# Altium project Digital Clock Schematic.PrjPcb
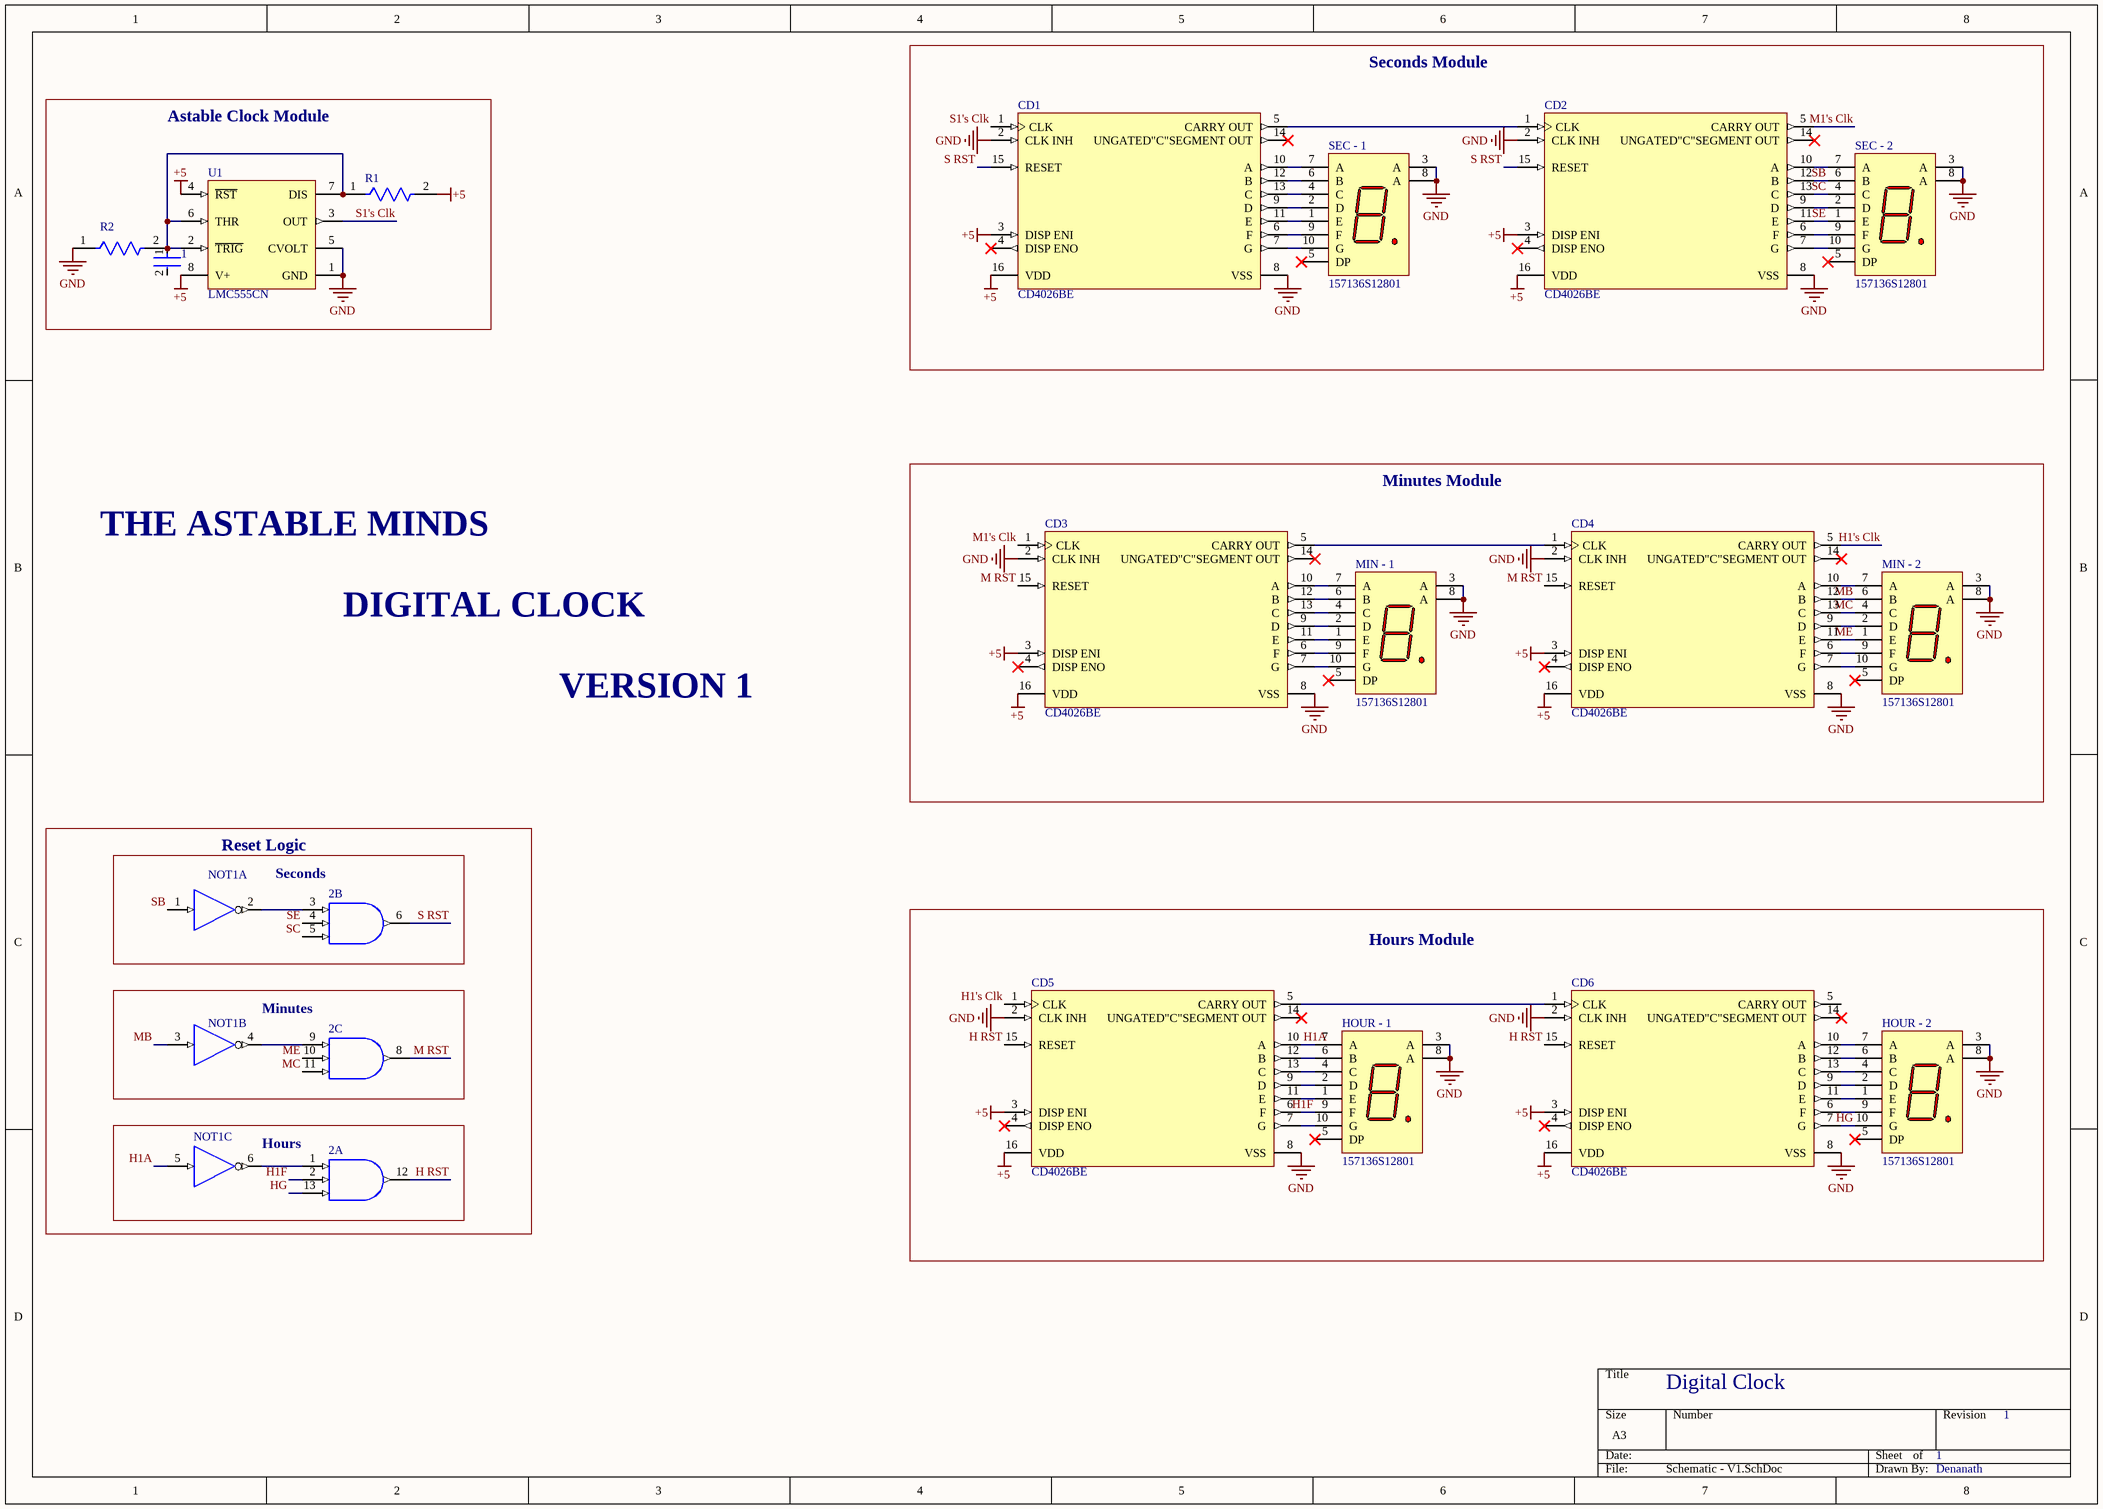
[diagram p0: Schematic - V1.SchDoc]
2 sheets, 43 parts. Net scope: global (net labels, ports and power ports of the same name join across sheets).
Sheets:
  Schematic - V1.SchDoc
  Schematic - V2.SchDoc

## Sheet Schematic - V1.SchDoc
size A3; SheetNumber: 1; SheetTotal: 2

### Parts
(Parts that share a designator on the sheet are numbered #1, #2 ... from top to bottom, then left to right.)
1#1  VY1472M63Y5UQ6TV0  [FP-VY1472M63Y5UQ6TV0-MFG]  (value not drawn)
2  SN74LS11N  [N0014A]  (value not drawn)  (parts A,B,C of 4)
CD1  CD4026BE  [N0016A]
CD2  CD4026BE  [N0016A]
CD3  CD4026BE  [N0016A]
CD4  CD4026BE  [N0016A]
CD5  CD4026BE  [N0016A]
CD6  CD4026BE  [N0016A]
HOUR_-_1  157136S12801  [WL-T7DS_L17.5W12.4H7]
HOUR_-_2  157136S12801  [WL-T7DS_L17.5W12.4H7]
MIN_-_1  157136S12801  [WL-T7DS_L17.5W12.4H7]
MIN_-_2  157136S12801  [WL-T7DS_L17.5W12.4H7]
NOT1  SN74HCU04N  [N0014A]  (value not drawn)  (parts A,B,C of 7)
R1#1  VR37000001204JA100  [FP-VR37-MFG]  (value not drawn)
R2#1  VR37000001204JA100  [FP-VR37-MFG]  (value not drawn)
SEC_-_1  157136S12801  [WL-T7DS_L17.5W12.4H7]
SEC_-_2  157136S12801  [WL-T7DS_L17.5W12.4H7]
U1#1  LMC555CN  [P0008A]

### Blocks framed on the sheet
Seconds Module: CD1 CD2 SEC_-_1 SEC_-_2
Astable Clock Module: 1#1 R1#1 R2#1 U1#1
Minutes Module: CD3 CD4 MIN_-_1 MIN_-_2
Reset Logic: 2 NOT1
Hours Module: CD5 CD6 HOUR_-_1 HOUR_-_2
Minutes: 2 NOT1
Hours: 2 NOT1

### Nets
+5: CD1.3(DISP_ENI) CD1.16(VDD) CD2.3(DISP_ENI) CD2.16(VDD) CD3.3(DISP_ENI) CD3.16(VDD) CD4.3(DISP_ENI) CD4.16(VDD) CD5.3(DISP_ENI) CD5.16(VDD) CD6.3(DISP_ENI) CD6.16(VDD) R1#1.2 U1#1.4(~{RST}) U1#1.8(V+)
GND: CD1.2(CLK_INH) CD1.8(VSS) CD2.2(CLK_INH) CD2.8(VSS) CD3.2(CLK_INH) CD3.8(VSS) CD4.2(CLK_INH) CD4.8(VSS) CD5.2(CLK_INH) CD5.8(VSS) CD6.2(CLK_INH) CD6.8(VSS) HOUR_-_1.3(A) HOUR_-_1.8(A) HOUR_-_2.3(A) HOUR_-_2.8(A) MIN_-_1.3(A) MIN_-_1.8(A) MIN_-_2.3(A) MIN_-_2.8(A) R2#1.1 SEC_-_1.3(A) SEC_-_1.8(A) SEC_-_2.3(A) SEC_-_2.8(A) U1#1.1(GND) U1#1.5(CVOLT)
H1's Clk: CD4.5(CARRY_OUT) CD5.1(CLK)
H1A: NOT1.5(3A)
H1F: 2.2(1B) CD5.6(F) HOUR_-_1.9(F)
H RST: 2.6(2Y) 2.8(3Y) 2.12(1Y) CD1.15(RESET) CD2.15(RESET) CD3.15(RESET) CD4.15(RESET) CD5.15(RESET) CD6.15(RESET)  [also labelled M RST, S RST]
HG: 2.13(1C) CD6.7(G) HOUR_-_2.10(G)
M1's Clk: CD2.5(CARRY_OUT) CD3.1(CLK)
MB: CD4.12(B) MIN_-_2.6(B) NOT1.3(2A)
MC: 2.11(3C) CD4.13(C) MIN_-_2.4(C)
ME: 2.10(3B) CD4.11(E) MIN_-_2.1(E)
S1's Clk: CD1.1(CLK) U1#1.3(OUT)
SB: CD2.12(B) NOT1.1(1A) SEC_-_2.6(B)
SC: 2.5(2C) CD2.13(C) SEC_-_2.4(C)
SE: 2.4(2B) CD2.11(E) SEC_-_2.1(E)
Net1#1_1: 1#1.1 R1#1.1 R2#1.2 U1#1.2(~{TRIG}) U1#1.6(THR) U1#1.7(DIS)
Net2_1: 2.1(1A) NOT1.6(~{3Y})
Net2_3: 2.3(2A) NOT1.2(~{1Y})
Net2_9: 2.9(3A) NOT1.4(~{2Y})
NetCD1_5: CD1.5(CARRY_OUT) CD2.1(CLK)
NetCD1_6: CD1.6(F) SEC_-_1.9(F)
NetCD1_7: CD1.7(G) SEC_-_1.10(G)
NetCD1_9: CD1.9(D) SEC_-_1.2(D)
NetCD1_10: CD1.10(A) SEC_-_1.7(A)
NetCD1_11: CD1.11(E) SEC_-_1.1(E)
NetCD1_12: CD1.12(B) SEC_-_1.6(B)
NetCD1_13: CD1.13(C) SEC_-_1.4(C)
NetCD2_6: CD2.6(F) SEC_-_2.9(F)
NetCD2_7: CD2.7(G) SEC_-_2.10(G)
NetCD2_9: CD2.9(D) SEC_-_2.2(D)
NetCD2_10: CD2.10(A) SEC_-_2.7(A)
NetCD3_5: CD3.5(CARRY_OUT) CD4.1(CLK)
NetCD3_6: CD3.6(F) MIN_-_1.9(F)
NetCD3_7: CD3.7(G) MIN_-_1.10(G)
NetCD3_9: CD3.9(D) MIN_-_1.2(D)
NetCD3_10: CD3.10(A) MIN_-_1.7(A)
NetCD3_11: CD3.11(E) MIN_-_1.1(E)
NetCD3_12: CD3.12(B) MIN_-_1.6(B)
NetCD3_13: CD3.13(C) MIN_-_1.4(C)
NetCD4_6: CD4.6(F) MIN_-_2.9(F)
NetCD4_7: CD4.7(G) MIN_-_2.10(G)
NetCD4_9: CD4.9(D) MIN_-_2.2(D)
NetCD4_10: CD4.10(A) MIN_-_2.7(A)
NetCD5_5: CD5.5(CARRY_OUT) CD6.1(CLK)
NetCD5_7: CD5.7(G) HOUR_-_1.10(G)
NetCD5_9: CD5.9(D) HOUR_-_1.2(D)
NetCD5_10: CD5.10(A) HOUR_-_1.7(A)
NetCD5_11: CD5.11(E) HOUR_-_1.1(E)
NetCD5_12: CD5.12(B) HOUR_-_1.6(B)
NetCD5_13: CD5.13(C) HOUR_-_1.4(C)
NetCD6_6: CD6.6(F) HOUR_-_2.9(F)
NetCD6_9: CD6.9(D) HOUR_-_2.2(D)
NetCD6_10: CD6.10(A) HOUR_-_2.7(A)
NetCD6_11: CD6.11(E) HOUR_-_2.1(E)
NetCD6_12: CD6.12(B) HOUR_-_2.6(B)
NetCD6_13: CD6.13(C) HOUR_-_2.4(C)

Not connected (* = marked no-connect by the designer): 1#1 2; CD1 4(DISP_ENO)* 14(UNGATED"C"SEGMENT_OUT)*; CD2 4(DISP_ENO)* 14(UNGATED"C"SEGMENT_OUT)*; CD3 4(DISP_ENO)* 14(UNGATED"C"SEGMENT_OUT)*; CD4 4(DISP_ENO)* 14(UNGATED"C"SEGMENT_OUT)*; CD5 4(DISP_ENO)* 14(UNGATED"C"SEGMENT_OUT)*; CD6 4(DISP_ENO)* 5(CARRY_OUT) 14(UNGATED"C"SEGMENT_OUT)*; HOUR_-_1 5(DP)*; HOUR_-_2 5(DP)*; MIN_-_1 5(DP)*; MIN_-_2 5(DP)*; SEC_-_1 5(DP)*; SEC_-_2 5(DP)*

### Notes on the sheet
- THE ASTABLE MINDS
- DIGITAL CLOCK
- VERSION 1
- (near 2) Seconds
- Digital Clock
- 1
- Denanath
- Labels drawn without touching a wire or pin: H1A

### Library data of the parts
1#1 = CMP-02417-000050-1: CAP CER 4700PF 760VAC Y5U RADIAL; Voltage Rating (AC): 500V; Lead Diameter: 0.6mm; Capacitance: 4.7nF; Tolerance: 20%; Lead/Base Style: Kinked; Termination: Radial; Resistor Type: Ceramic; Radiation Hardening: No; Diameter: 16mm; Max Operating Temperature: 125°C; Case/Package: Radial; Thickness: 5mm; Lead Pitch: 10mm; Series: VY1; Contact Plating: Tin; Depth: 5mm; RoHS Compliant: Yes; Voltage: 500V; Voltage Rating (DC): 500V; Package Quantity: 500; Construction: RADIAL; Min Operating Temperature: -40°C; Height: 19mm; Height - Seated (Max): 0.787inch; Packaging: Tape and Reel; Dielectric: Y5U; Mount: Through Hole
2 = CMP-0777-00254-3: Triple 3-input positive-AND gates, N0014A, TUBE; Manufacturer: Texas Instruments; Output Type: TTL; VCC(Min)(V): 4.75; Technology Family: LS; Bits(#): 3; Voltage(Nom)(V): 5; ICC @ Nom Voltage(Max)(mA): 0.0036; Rating: Catalog; VCC(Max)(V): 5.25; tpd @ Nom Voltage(Max)(ns): 15; Output Drive (IOL/IOH)(Max)(mA): 0/8; F @ Nom Voltage(Max)(Mhz): 35; Schmitt Trigger: No; Input Type: TTL; DatasheetVersion: SDLS131; PackageReference: N0014A; Operating Temperature Range(C): 0 to 70; Generic Part Number: SN74LS11
CD1-CD6 = CMP-1623-00561-2: CMOS Decade Counter/Divider with Decoded 7-Segment Display Outputs and Display Enable, N0016A, TUBE; Manufacturer: Texas Instruments; ICC @ Nom Voltage(Max)(mA): 0.03; tpd @ Nom Voltage(Max)(ns): 250; F @ Nom Voltage(Max)(Mhz): 8; Bits(#): 7; VCC(Max)(V): 18; VCC(Min)(V): 3; Output Drive (IOL/IOH)(Max)(mA): 1.5/-1.5; Inputs: 1; Rating: Catalog; Technology Family: CD4000; Schmitt Trigger: No; Voltage(Nom)(V): 5,10,15; DatasheetVersion: SCHS031B; Operating Temperature Range(C): -55 to 125; Code_JEDEC: MS-001; Input Type: CMOS; Output Type: CMOS; Type: Decade; Generic Part Number: CD4026B; PackageReference: N0016A; Function: Counter
HOUR_-_1 HOUR_-_2 MIN_-_1 MIN_-_2 SEC_-_1 SEC_-_2 = CMP-03913-119893999-3: 7-Seg Display, Comm Anode, Super Red Rohs Compliant: Yes; Forward Voltage: 2V; Dominant Wavelength: 635nm; Max Reverse Voltage (DC): 5V; Forward Current: 100mA; Luminous Intensity: 20mcd; Width: 12.4mm; Max Operating Temperature: 85°C; Min Operating Temperature: -40°C; Height: 7mm; RoHS: Compliant; Length: 17.5mm
NOT1 = CMP-1615-00910-2: Hex Inverters, N0014A, TUBE; Manufacturer: Texas Instruments; Technology Family: HC; Bits(#): 6; Schmitt Trigger: No; Output Drive (IOL/IOH)(Max)(mA): -4/4; Input Type: CMOS; F @ Nom Voltage(Max)(Mhz): 20; VCC(Min)(V): 2; Voltage(Nom)(V): 5; ICC @ Nom Voltage(Max)(mA): 0.02; Rating: Catalog; Operating Temperature Range(C): -40 to 85; Generic Part Number: SN74HCU04; VCC(Max)(V): 6; PackageReference: N0014A; tpd @ Nom Voltage(Max)(ns): 20; Output Type: CMOS; Code_JEDEC: MS-001; DatasheetVersion: SCLS079E
R1#1 R2#1 = CMP-02408-000054-1: RES 1.2M OHM 5% 1/2W AXIAL; Voltage Rating: 3.5kV; Power Rating: 500mW; Temperature Coefficient: 200ppm/°C; Resistance: 1.2MR; Diameter: 4mm; Max Operating Temperature: 155°C; Military Standard: Not; Reach SVHC Compliant: Yes; Min Operating Temperature: -55°C; Resistance Tolerance: 5%; Resistor Type: Metal Film; Tolerance: 5%; Mount: Through Hole; Construction: Cylindrical; Contact Plating: Tin; Length: 10mm; Termination: Axial; Voltage Rating (DC): 3.5kV; Packaging: Ammo Pack; Radiation Hardening: No; Case/Package: Conformal
U1#1 = CMP-0056-00035-3: CMOS Timer, 8-pin MDIP; Manufacturer: Texas Instruments; PowerWise: N; CompType: Analog IC; PackageTopMarking: NSUZXYTTE#*LMC*555CN; PackageReference: P0008A; ComponentLink1Description: Datasheet URL; PinCount: 8; ComponentLink1URL: http://www.ti.com/general/docs/lit/getliterature.tsp?genericPartNumber=LMC555&fileType=pdf; PackageDescription: MDIP, .365 x .250 x .130in, 8 Lead, .100in Pitch; RoHS: N; Code_JEDEC: MS-001-BA

## Sheet Schematic - V2.SchDoc
size A3; SheetNumber: 2; SheetTotal: 2
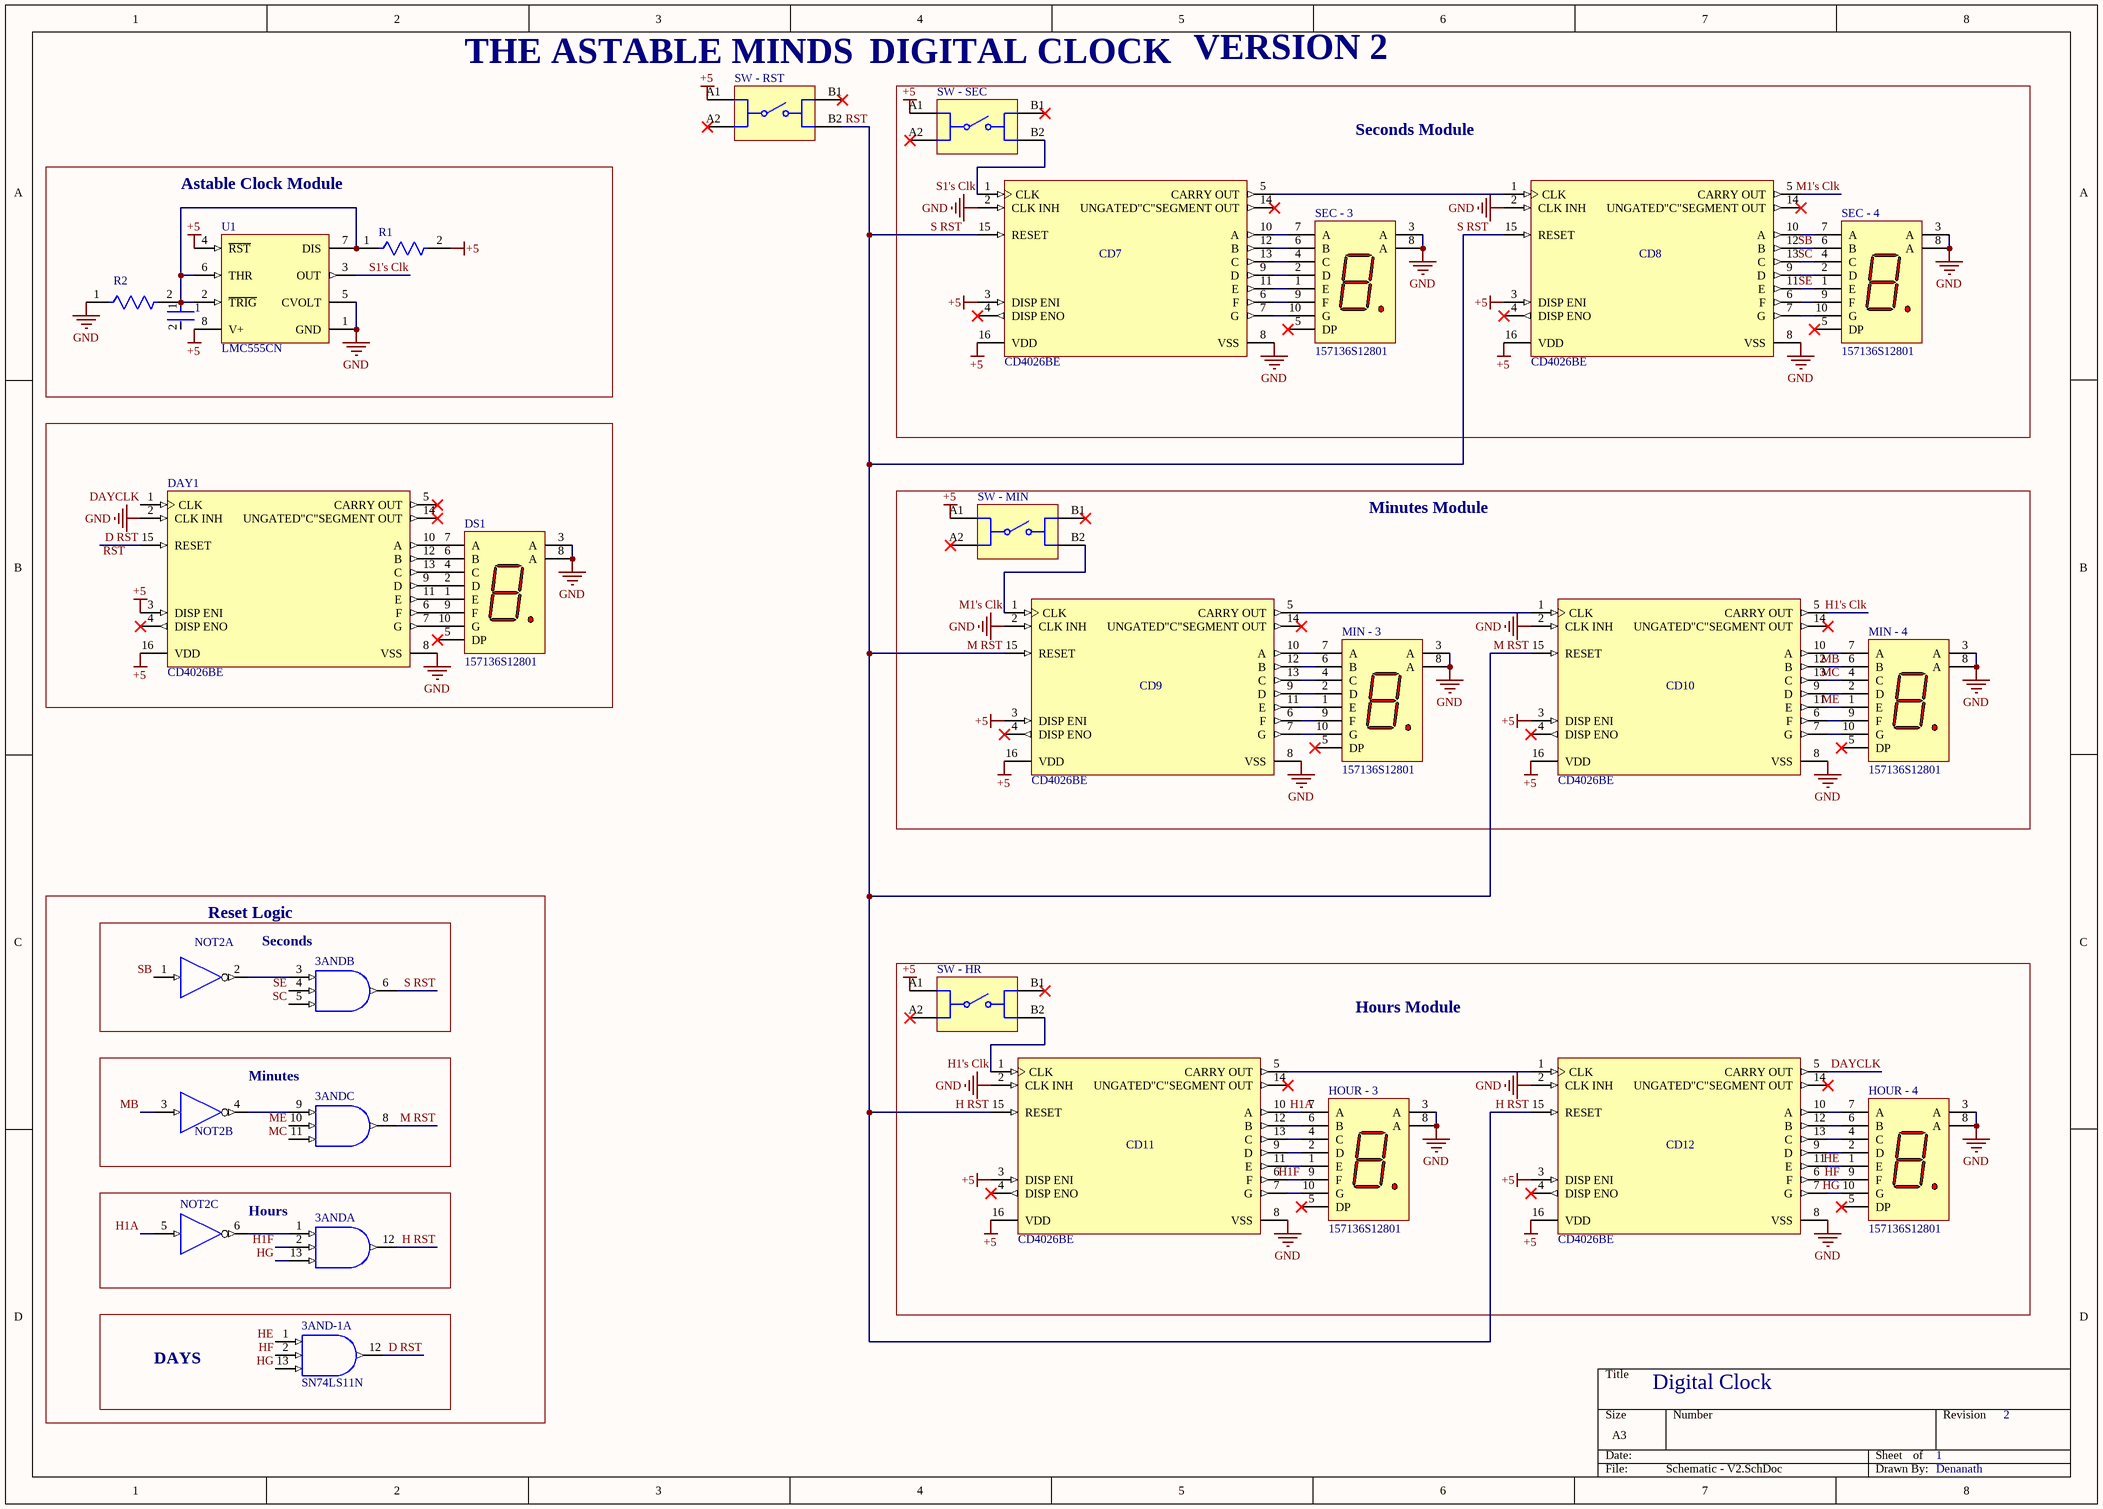
[diagram p1: Schematic - V2.SchDoc]

### Parts
(Parts that share a designator on the sheet are numbered #1, #2 ... from top to bottom, then left to right.)
1#2  VY1472M63Y5UQ6TV0  [FP-VY1472M63Y5UQ6TV0-MFG]  (value not drawn)
3AND  SN74LS11N  [N0014A]  (value not drawn)  (parts A,B,C of 4)
3AND-1  SN74LS11N  [N0014A]  (part A of 4)
CD7  CD4026BE  [N0016A]
CD8  CD4026BE  [N0016A]
CD9  CD4026BE  [N0016A]
CD10  CD4026BE  [N0016A]
CD11  CD4026BE  [N0016A]
CD12  CD4026BE  [N0016A]
DAY1  CD4026BE  [N0016A]
DS1  157136S12801  [WL-T7DS_L17.5W12.4H7]
HOUR_-_3  157136S12801  [WL-T7DS_L17.5W12.4H7]
HOUR_-_4  157136S12801  [WL-T7DS_L17.5W12.4H7]
MIN_-_3  157136S12801  [WL-T7DS_L17.5W12.4H7]
MIN_-_4  157136S12801  [WL-T7DS_L17.5W12.4H7]
NOT2  SN74HCU04N  [N0014A]  (value not drawn)  (parts A,B,C of 7)
R1#2  VR37000001204JA100  [FP-VR37-MFG]  (value not drawn)
R2#2  VR37000001204JA100  [FP-VR37-MFG]  (value not drawn)
SEC_-_3  157136S12801  [WL-T7DS_L17.5W12.4H7]
SEC_-_4  157136S12801  [WL-T7DS_L17.5W12.4H7]
SW_-_HR  430186050716  [430186050716]  (value not drawn)
SW_-_MIN  430186050716  [430186050716]  (value not drawn)
SW_-_RST  430186050716  [430186050716]  (value not drawn)
SW_-_SEC  430186050716  [430186050716]  (value not drawn)
U1#2  LMC555CN  [P0008A]

### Blocks framed on the sheet
VERSION 2: CD7 CD8 SEC_-_3 SEC_-_4 SW_-_SEC
Astable Clock Module: 1#2 R1#2 R2#2 U1#2
Minutes Module: CD9 CD10 MIN_-_3 MIN_-_4 SW_-_MIN
Reset Logic: 3AND NOT2
Hours Module: CD11 CD12 HOUR_-_3 HOUR_-_4 SW_-_HR
Minutes: 3AND NOT2
Hours: 3AND NOT2
DAYS: 3AND-1

### Nets
+5: CD7.3(DISP_ENI) CD7.16(VDD) CD8.3(DISP_ENI) CD8.16(VDD) CD9.3(DISP_ENI) CD9.16(VDD) CD10.3(DISP_ENI) CD10.16(VDD) CD11.3(DISP_ENI) CD11.16(VDD) CD12.3(DISP_ENI) CD12.16(VDD) DAY1.3(DISP_ENI) DAY1.16(VDD) R1#2.2 SW_-_HR.A1 SW_-_MIN.A1 SW_-_RST.A1 SW_-_SEC.A1 U1#2.4(~{RST}) U1#2.8(V+)
GND: CD7.2(CLK_INH) CD7.8(VSS) CD8.2(CLK_INH) CD8.8(VSS) CD9.2(CLK_INH) CD9.8(VSS) CD10.2(CLK_INH) CD10.8(VSS) CD11.2(CLK_INH) CD11.8(VSS) CD12.2(CLK_INH) CD12.8(VSS) DAY1.2(CLK_INH) DAY1.8(VSS) DS1.3(A) DS1.8(A) HOUR_-_3.3(A) HOUR_-_3.8(A) HOUR_-_4.3(A) HOUR_-_4.8(A) MIN_-_3.3(A) MIN_-_3.8(A) MIN_-_4.3(A) MIN_-_4.8(A) R2#2.1 SEC_-_3.3(A) SEC_-_3.8(A) SEC_-_4.3(A) SEC_-_4.8(A) U1#2.1(GND) U1#2.5(CVOLT)
D RST: 3AND-1.12(1Y) DAY1.15(RESET)
DAYCLK: CD12.5(CARRY_OUT) DAY1.1(CLK)
H1's Clk: CD10.5(CARRY_OUT) CD11.1(CLK) SW_-_HR.B2
H1A: NOT2.5(3A)
H1F: 3AND.2(1B) CD11.6(F) HOUR_-_3.9(F)
H RST: 3AND.6(2Y) 3AND.8(3Y) 3AND.12(1Y) CD7.15(RESET) CD8.15(RESET) CD9.15(RESET) CD10.15(RESET) CD11.15(RESET) CD12.15(RESET) SW_-_RST.B2  [also labelled M RST, RST, S RST]
HE: 3AND-1.1(1A) CD12.11(E) HOUR_-_4.1(E)
HF: 3AND-1.2(1B) CD12.6(F) HOUR_-_4.9(F)
HG: 3AND.13(1C) 3AND-1.13(1C) CD12.7(G) HOUR_-_4.10(G)
M1's Clk: CD8.5(CARRY_OUT) CD9.1(CLK) SW_-_MIN.B2
MB: CD10.12(B) MIN_-_4.6(B) NOT2.3(2A)
MC: 3AND.11(3C) CD10.13(C) MIN_-_4.4(C)
ME: 3AND.10(3B) CD10.11(E) MIN_-_4.1(E)
S1's Clk: CD7.1(CLK) SW_-_SEC.B2 U1#2.3(OUT)
SB: CD8.12(B) NOT2.1(1A) SEC_-_4.6(B)
SC: 3AND.5(2C) CD8.13(C) SEC_-_4.4(C)
SE: 3AND.4(2B) CD8.11(E) SEC_-_4.1(E)
Net1#2_1: 1#2.1 R1#2.1 R2#2.2 U1#2.2(~{TRIG}) U1#2.6(THR) U1#2.7(DIS)
Net3AND_1: 3AND.1(1A) NOT2.6(~{3Y})
Net3AND_3: 3AND.3(2A) NOT2.2(~{1Y})
Net3AND_9: 3AND.9(3A) NOT2.4(~{2Y})
NetCD7_5: CD7.5(CARRY_OUT) CD8.1(CLK)
NetCD7_6: CD7.6(F) SEC_-_3.9(F)
NetCD7_7: CD7.7(G) SEC_-_3.10(G)
NetCD7_9: CD7.9(D) SEC_-_3.2(D)
NetCD7_10: CD7.10(A) SEC_-_3.7(A)
NetCD7_11: CD7.11(E) SEC_-_3.1(E)
NetCD7_12: CD7.12(B) SEC_-_3.6(B)
NetCD7_13: CD7.13(C) SEC_-_3.4(C)
NetCD8_6: CD8.6(F) SEC_-_4.9(F)
NetCD8_7: CD8.7(G) SEC_-_4.10(G)
NetCD8_9: CD8.9(D) SEC_-_4.2(D)
NetCD8_10: CD8.10(A) SEC_-_4.7(A)
NetCD9_5: CD9.5(CARRY_OUT) CD10.1(CLK)
NetCD9_6: CD9.6(F) MIN_-_3.9(F)
NetCD9_7: CD9.7(G) MIN_-_3.10(G)
NetCD9_9: CD9.9(D) MIN_-_3.2(D)
NetCD9_10: CD9.10(A) MIN_-_3.7(A)
NetCD9_11: CD9.11(E) MIN_-_3.1(E)
NetCD9_12: CD9.12(B) MIN_-_3.6(B)
NetCD9_13: CD9.13(C) MIN_-_3.4(C)
NetCD10_6: CD10.6(F) MIN_-_4.9(F)
NetCD10_7: CD10.7(G) MIN_-_4.10(G)
NetCD10_9: CD10.9(D) MIN_-_4.2(D)
NetCD10_10: CD10.10(A) MIN_-_4.7(A)
NetCD11_5: CD11.5(CARRY_OUT) CD12.1(CLK)
NetCD11_7: CD11.7(G) HOUR_-_3.10(G)
NetCD11_9: CD11.9(D) HOUR_-_3.2(D)
NetCD11_10: CD11.10(A) HOUR_-_3.7(A)
NetCD11_11: CD11.11(E) HOUR_-_3.1(E)
NetCD11_12: CD11.12(B) HOUR_-_3.6(B)
NetCD11_13: CD11.13(C) HOUR_-_3.4(C)
NetCD12_9: CD12.9(D) HOUR_-_4.2(D)
NetCD12_10: CD12.10(A) HOUR_-_4.7(A)
NetCD12_12: CD12.12(B) HOUR_-_4.6(B)
NetCD12_13: CD12.13(C) HOUR_-_4.4(C)
NetDAY1_6: DAY1.6(F) DS1.9(F)
NetDAY1_7: DAY1.7(G) DS1.10(G)
NetDAY1_9: DAY1.9(D) DS1.2(D)
NetDAY1_10: DAY1.10(A) DS1.7(A)
NetDAY1_11: DAY1.11(E) DS1.1(E)
NetDAY1_12: DAY1.12(B) DS1.6(B)
NetDAY1_13: DAY1.13(C) DS1.4(C)

Not connected (* = marked no-connect by the designer): 1#2 2; CD7 4(DISP_ENO)* 14(UNGATED"C"SEGMENT_OUT)*; CD8 4(DISP_ENO)* 14(UNGATED"C"SEGMENT_OUT)*; CD9 4(DISP_ENO)* 14(UNGATED"C"SEGMENT_OUT)*; CD10 4(DISP_ENO)* 14(UNGATED"C"SEGMENT_OUT)*; CD11 4(DISP_ENO)* 14(UNGATED"C"SEGMENT_OUT)*; CD12 4(DISP_ENO)* 14(UNGATED"C"SEGMENT_OUT)*; DAY1 4(DISP_ENO)* 5(CARRY_OUT)* 14(UNGATED"C"SEGMENT_OUT)*; DS1 5(DP)*; HOUR_-_3 5(DP)*; HOUR_-_4 5(DP)*; MIN_-_3 5(DP)*; MIN_-_4 5(DP)*; SEC_-_3 5(DP)*; SEC_-_4 5(DP)*; SW_-_HR A2* B1*; SW_-_MIN A2* B1*; SW_-_RST A2* B1*; SW_-_SEC A2* B1*

### Notes on the sheet
- (near SW_-_RST) THE ASTABLE MINDS
- DIGITAL CLOCK
- Seconds Module
- (near 3AND) Seconds
- Digital Clock
- 1
- 2
- Denanath
- Labels drawn without touching a wire or pin: H1A, RST

### Library data of the parts
1#2 = CMP-02417-000050-1: as 1#1 on sheet Schematic - V1; Termination: Radial; Resistor Type: Ceramic; Radiation Hardening: No; Diameter: 16mm; Max Operating Temperature: 125°C; Case/Package: Radial; Thickness: 5mm; Lead Pitch: 10mm; Series: VY1; Contact Plating: Tin; Depth: 5mm; RoHS Compliant: Yes; Voltage: 500V; Voltage Rating (DC): 500V; Package Quantity: 500; Construction: RADIAL; Min Operating Temperature: -40°C; Height: 19mm; Height - Seated (Max): 0.787inch; Packaging: Tape and Reel; Dielectric: Y5U; Mount: Through Hole
3AND 3AND-1 = CMP-0777-00254-3: as 2 on sheet Schematic - V1; Input Type: TTL; DatasheetVersion: SDLS131; PackageReference: N0014A; Operating Temperature Range(C): 0 to 70; Generic Part Number: SN74LS11
CD7-CD12 DAY1 = CMP-1623-00561-2: as CD1 on sheet Schematic - V1; DatasheetVersion: SCHS031B; Operating Temperature Range(C): -55 to 125; Code_JEDEC: MS-001; Input Type: CMOS; Output Type: CMOS; Type: Decade; Generic Part Number: CD4026B; PackageReference: N0016A; Function: Counter
DS1 HOUR_-_3 HOUR_-_4 MIN_-_3 MIN_-_4 SEC_-_3 SEC_-_4 = CMP-03913-119893999-3: as HOUR_-_1 on sheet Schematic - V1; Width: 12.4mm; Max Operating Temperature: 85°C; Min Operating Temperature: -40°C; Height: 7mm; RoHS: Compliant; Length: 17.5mm
NOT2 = CMP-1615-00910-2: as NOT1 on sheet Schematic - V1; Operating Temperature Range(C): -40 to 85; Generic Part Number: SN74HCU04; VCC(Max)(V): 6; PackageReference: N0014A; tpd @ Nom Voltage(Max)(ns): 20; Output Type: CMOS; Code_JEDEC: MS-001; DatasheetVersion: SCLS079E
R1#2 R2#2 = CMP-02408-000054-1: as R1#1 on sheet Schematic - V1; Diameter: 4mm; Max Operating Temperature: 155°C; Military Standard: Not; Reach SVHC Compliant: Yes; Min Operating Temperature: -55°C; Resistance Tolerance: 5%; Resistor Type: Metal Film; Tolerance: 5%; Mount: Through Hole; Construction: Cylindrical; Contact Plating: Tin; Length: 10mm; Termination: Axial; Voltage Rating (DC): 3.5kV; Packaging: Ammo Pack; Radiation Hardening: No; Case/Package: Conformal
SW_-_HR SW_-_MIN SW_-_RST SW_-_SEC = CMP-1453-00012-5: Switch Tactile Spst-no 0.05A 12V; Switch Function: Off-Mom; Actuator Material: Liquid Crystal Polymer, Polymer; Insulation Resistance: 100MΩ; Mechanical Life: 1Mcycles; Switch Travel: 250µm; Throw Configuration: SPST; Contact Current Rating: 50mA; Illumination Type: Illuminated, Non-Illuminated; Length: 6.2mm; Voltage Rating: 12V; Max Operating Temperature: 85°C; Min Operating Temperature: -40°C; REACH SVHC: No; Width: 6.2mm; Mount: Through Hole; Contact Plating: Silver; RoHS: Compliant; Height: 5mm; Diameter: 3.5mm; Termination: PC Pin; Contact Material: Steel; Current Rating: 50mA; Packaging: Bulk; Color: Black
U1#2 = CMP-0056-00035-3: as U1#1 on sheet Schematic - V1; PackageReference: P0008A; ComponentLink1Description: Datasheet URL; PinCount: 8; ComponentLink1URL: http://www.ti.com/general/docs/lit/getliterature.tsp?genericPartNumber=LMC555&fileType=pdf; PackageDescription: MDIP, .365 x .250 x .130in, 8 Lead, .100in Pitch; RoHS: N; Code_JEDEC: MS-001-BA

## Nets that join several sheets
+5: Schematic - V1 (15 pins), Schematic - V2 (21 pins)
GND: Schematic - V1 (27 pins), Schematic - V2 (31 pins)
H1's Clk: Schematic - V1 (CD4.5 CD5.1), Schematic - V2 (CD10.5 CD11.1 SW_-_HR.B2)
H1A: Schematic - V1 (NOT1.5), Schematic - V2 (NOT2.5)
H1F: Schematic - V1 (2.2 CD5.6 HOUR_-_1.9), Schematic - V2 (3AND.2 CD11.6 HOUR_-_3.9)
H RST: Schematic - V1 (9 pins), Schematic - V2 (10 pins)
HG: Schematic - V1 (2.13 CD6.7 HOUR_-_2.10), Schematic - V2 (3AND.13 3AND-1.13 CD12.7 HOUR_-_4.10)
M1's Clk: Schematic - V1 (CD2.5 CD3.1), Schematic - V2 (CD8.5 CD9.1 SW_-_MIN.B2)
MB: Schematic - V1 (CD4.12 MIN_-_2.6 NOT1.3), Schematic - V2 (CD10.12 MIN_-_4.6 NOT2.3)
MC: Schematic - V1 (2.11 CD4.13 MIN_-_2.4), Schematic - V2 (3AND.11 CD10.13 MIN_-_4.4)
ME: Schematic - V1 (2.10 CD4.11 MIN_-_2.1), Schematic - V2 (3AND.10 CD10.11 MIN_-_4.1)
S1's Clk: Schematic - V1 (CD1.1 U1#1.3), Schematic - V2 (CD7.1 SW_-_SEC.B2 U1#2.3)
SB: Schematic - V1 (CD2.12 NOT1.1 SEC_-_2.6), Schematic - V2 (CD8.12 NOT2.1 SEC_-_4.6)
SC: Schematic - V1 (2.5 CD2.13 SEC_-_2.4), Schematic - V2 (3AND.5 CD8.13 SEC_-_4.4)
SE: Schematic - V1 (2.4 CD2.11 SEC_-_2.1), Schematic - V2 (3AND.4 CD8.11 SEC_-_4.1)